# Altium project 三串均衡电池架.PrjPcb
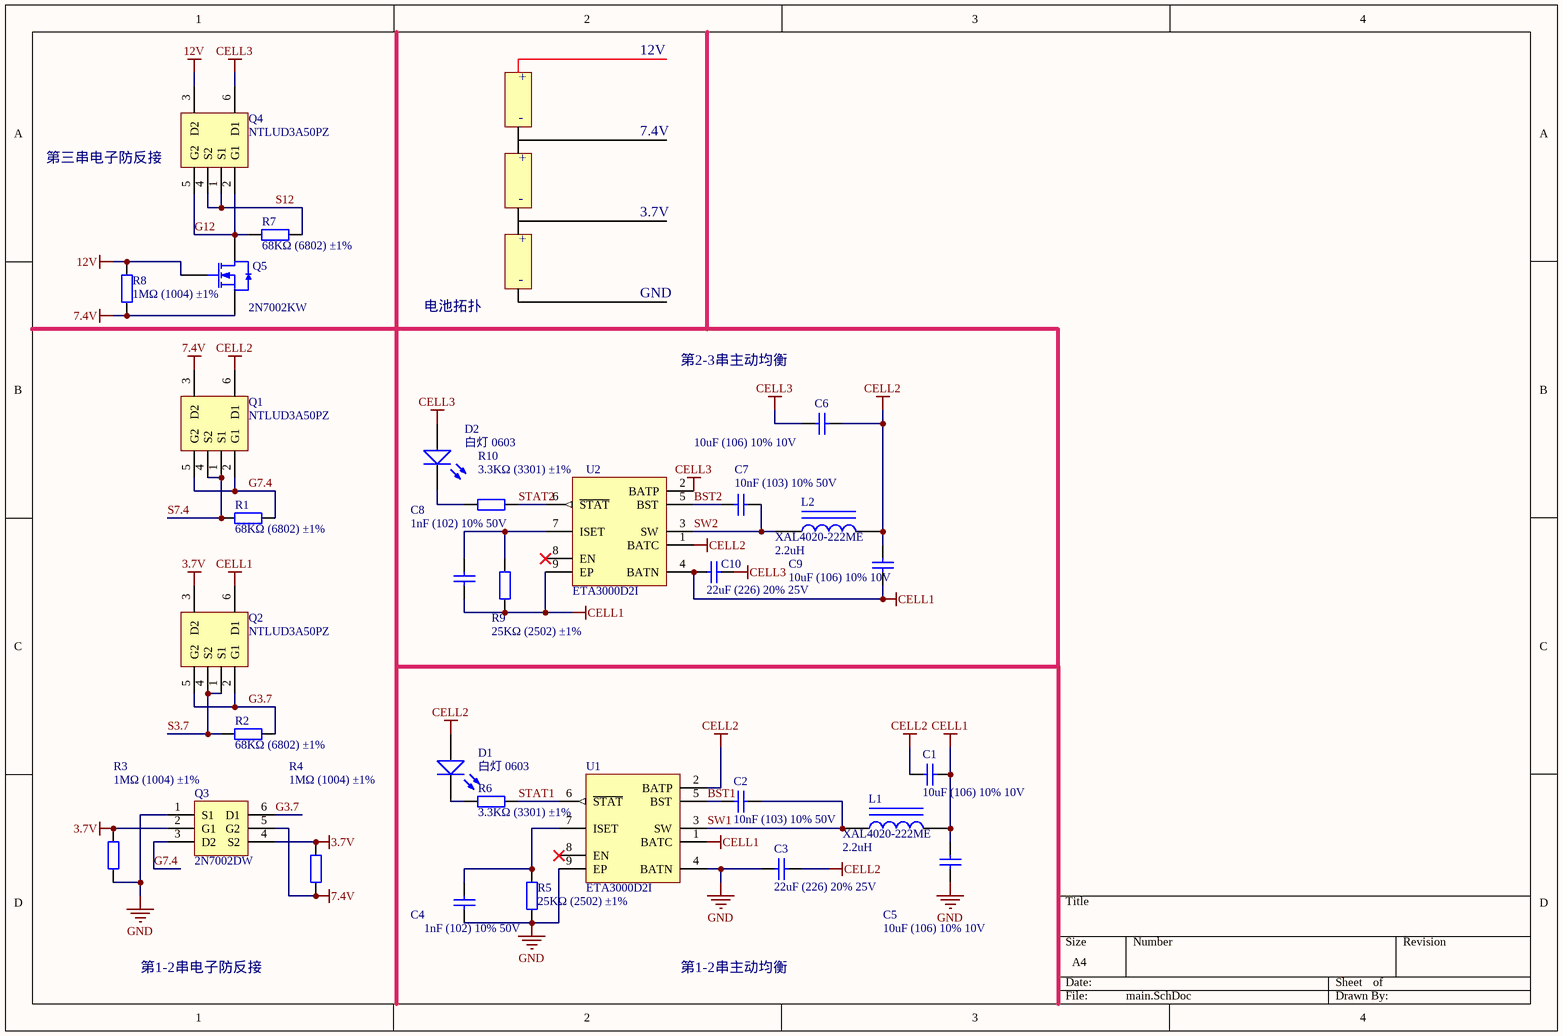
[diagram p0: main.SchDoc]
1 sheet, 31 parts. Net scope: global (net labels, ports and power ports of the same name join across sheets).
Board file: PCB1.PcbDoc

## Sheet main.SchDoc
size A4

### Parts
C1  10uF (106) 10% 10V  [0603_C]
C2  10nF (103) 10% 50V  [0402_C]
C3  22uF (226) 20% 25V  [0805_C]
C4  1nF (102) 10% 50V  [0402_C]
C5  10uF (106) 10% 10V  [0603_C]
C6  10uF (106) 10% 10V  [0603_C]
C7  10nF (103) 10% 50V  [0402_C]
C8  1nF (102) 10% 50V  [0402_C]
C9  10uF (106) 10% 10V  [0603_C]
C10  22uF (226) 20% 25V  [0805_C]
D1  白灯 0603  [0603_LED_S1]
D2  白灯 0603  [0603_LED_S1]
L1  XAL4020-222ME  value 2.2uH  [XAL4020-xxxME]
L2  XAL4020-222ME  value 2.2uH  [XAL4020-xxxME]
Q1  NTLUD3A50PZ  [UDFN-6_L2.0-W2.0-P0.65-BL_NTLUD3A50PZ]
Q2  NTLUD3A50PZ  [UDFN-6_L2.0-W2.0-P0.65-BL_NTLUD3A50PZ]
Q3  2N7002DW  [SC70-6]
Q4  NTLUD3A50PZ  [UDFN-6_L2.0-W2.0-P0.65-BL_NTLUD3A50PZ]
Q5  2N7002KW  [SC70-3]
R1  68KΩ (6802) ±1%  [0402_R]
R2  68KΩ (6802) ±1%  [0402_R]
R3  1MΩ (1004) ±1%  [0402_R]
R4  1MΩ (1004) ±1%  [0402_R]
R5  25KΩ (2502) ±1%  [0402_R]
R6  3.3KΩ (3301) ±1%  [0402_R]
R7  68KΩ (6802) ±1%  [0402_R]
R8  1MΩ (1004) ±1%  [0402_R]
R9  25KΩ (2502) ±1%  [0402_R]
R10  3.3KΩ (3301) ±1%  [0402_R]
U1  ETA3000D2I  [DFN2x2-8L]
U2  ETA3000D2I  [DFN2x2-8L]

### Nets
3.7V: Q2.3(D2) Q3.2(G1) Q3.4(S2) R3.2 R4.2
7.4V: Q1.3(D2) Q3.5(G2) Q5.2(S) R4.1 R8.1
12V: Q4.3(D2) Q5.1(G) R8.2
CELL1: C1.2 C5.2 C8.1 C9.1 C10.1 L1.2 Q2.6(D1) R9.1 U1.1(BATC) U2.4(BATN) U2.9(EP)
CELL2: C1.1 C3.2 C6.2 C9.2 D1.A L2.2 Q1.6(D1) U1.2(BATP) U2.1(BATC)
CELL3: C6.1 C10.2 D2.A Q4.6(D1) U2.2(BATP)
GND: C3.1 C4.1 C5.1 Q3.1(S1) R3.1 R5.1 U1.4(BATN) U1.9(EP)
BST1: C2.2 U1.5(BST)
BST2: C7.1 U2.5(BST)
G3.7: Q2.2(G1) Q2.5(G2) Q3.6(D1) R2.2
G7.4: Q1.2(G1) Q1.5(G2) Q3.3(D2) R1.2
G12: Q4.2(G1) Q4.5(G2) Q5.3(D) R7.1
S3.7: Q2.1(S1) Q2.4(S2) R2.1
S7.4: Q1.1(S1) Q1.4(S2) R1.1
S12: Q4.1(S1) Q4.4(S2) R7.2
STAT1: R6.2 U1.6(~{STAT})
STAT2: R10.2 U2.6(~{STAT})
SW1: C2.1 L1.1 U1.3(SW)
SW2: C7.2 L2.1 U2.3(SW)
NetC4_2: C4.2 R5.2 U1.7(ISET)
NetC8_2: C8.2 R9.2 U2.7(ISET)
NetD1_K: D1.K R6.1
NetD2_K: D2.K R10.1

Not connected (* = marked no-connect by the designer): U1 8(EN)*; U2 8(EN)*

### Notes on the sheet
- +
- 12V
- 第三串电子防反接
- -
- 7.4V
- 3.7V
- 电池拓扑
- GND
- 第2-3串主动均衡
- 第1-2串电子防反接
- 第1-2串主动均衡

### Library data of the parts
C1 C5 C6 C9 = 0603 10uF (106) 10% 10V: 贴片电容; ComponentLink1Description: 供应商链接; ComponentLink1URL: http://www.szlcsc.com/product/details_20411.html; Package: 0603; Supplier: LC; SuppliersPartNumber: C19702
C2 C7 = 0402 10nF (103) 10% 50V: 贴片电容; ComponentLink1Description: 供应商链接; ComponentLink1URL: http://www.szlcsc.com/product/details_15869.html; Package: 0402; Supplier: LC; SuppliersPartNumber: C15195
C3 C10 = 0805 22uF (226) 20% 25V: 贴片电容; ComponentLink1Description: 供应商链接; ComponentLink1URL: http://www.szlcsc.com/product/details_46786.html; Package: 0805; Supplier: LC; SuppliersPartNumber: C45783
C4 C8 = 0402 1nF (102) 10% 50V: 贴片电容; ComponentLink1Description: 供应商链接; ComponentLink1URL: http://www.szlcsc.com/product/details_1875.html; Package: 0402; Supplier: LC; SuppliersPartNumber: C1523
D1 D2 = 0603 白灯: 发光二极管; ComponentLink1Description: 供应商链接; ComponentLink1URL: http://www.szlcsc.com/product/details_2663.html; Package: 0603; Supplier: LC; SuppliersPartNumber: C2290
L1 L2 = Inductor Iron: Coilcraft XAL4020 Series; Published: 24-Mar-1999; LatestRevisionDate: 17-Jul-2002; LatestRevisionNote: Re-released for DXP Platform.; PackageReference: AXIAL-0.9; Publisher: Altium Limited; PackageDescription: Axial Device, Thru-Hole; 2 Leads; 0.9 in Pin Spacing
Q1 Q2 Q4 = NTLUD3A50PZ: Dual Symmetric P-MOS -20V -5.6A
Q3 = 2N7002DW: Dual N-Channel MOSFET 60V340mA SOT-363
Q5 = 2N7002 7002: MOS(场效应管); ComponentLink1Description: 供应商链接; ComponentLink1URL: http://www.szlcsc.com/product/details_9040.html; Package: SOT-323; Supplier: LC; SuppliersPartNumber: C???????
R1 R2 R7 = 0402 68KΩ (6802) 1%: 贴片电阻; ComponentLink1Description: 供应商链接; ComponentLink1URL: http://www.szlcsc.com/product/details_37849.html; Package: 0402; Supplier: LC; SuppliersPartNumber: C36871
R3 R4 R8 = 0402 1MΩ (1004) 1%: 贴片电阻; ComponentLink1Description: 供应商链接; ComponentLink1URL: http://www.szlcsc.com/product/details_26826.html; Package: 0402; Supplier: LC; SuppliersPartNumber: C26083
R5 R9 = 0402 20KΩ (2002) 1%: 贴片电阻; ComponentLink1Description: 供应商链接; ComponentLink1URL: http://www.szlcsc.com/product/details_26508.html; Package: 0402; Supplier: LC; SuppliersPartNumber: C???????
R6 R10 = 0402 3.3KΩ (3301) 1%: 贴片电阻; ComponentLink1Description: 供应商链接; ComponentLink1URL: http://www.szlcsc.com/product/details_26633.html; Package: 0402; Supplier: LC; SuppliersPartNumber: C25890
U1 U2 = ETA3000D2I: 2串锂电池电感主动均衡芯片,DFN2*2封装 2A均衡电流